# Altium schematic sheet 220VAC_to_24VDC.SchDoc
size 165 x 241 mm; DocumentNumber: 1; SheetNumber: 1; SheetTotal: 3
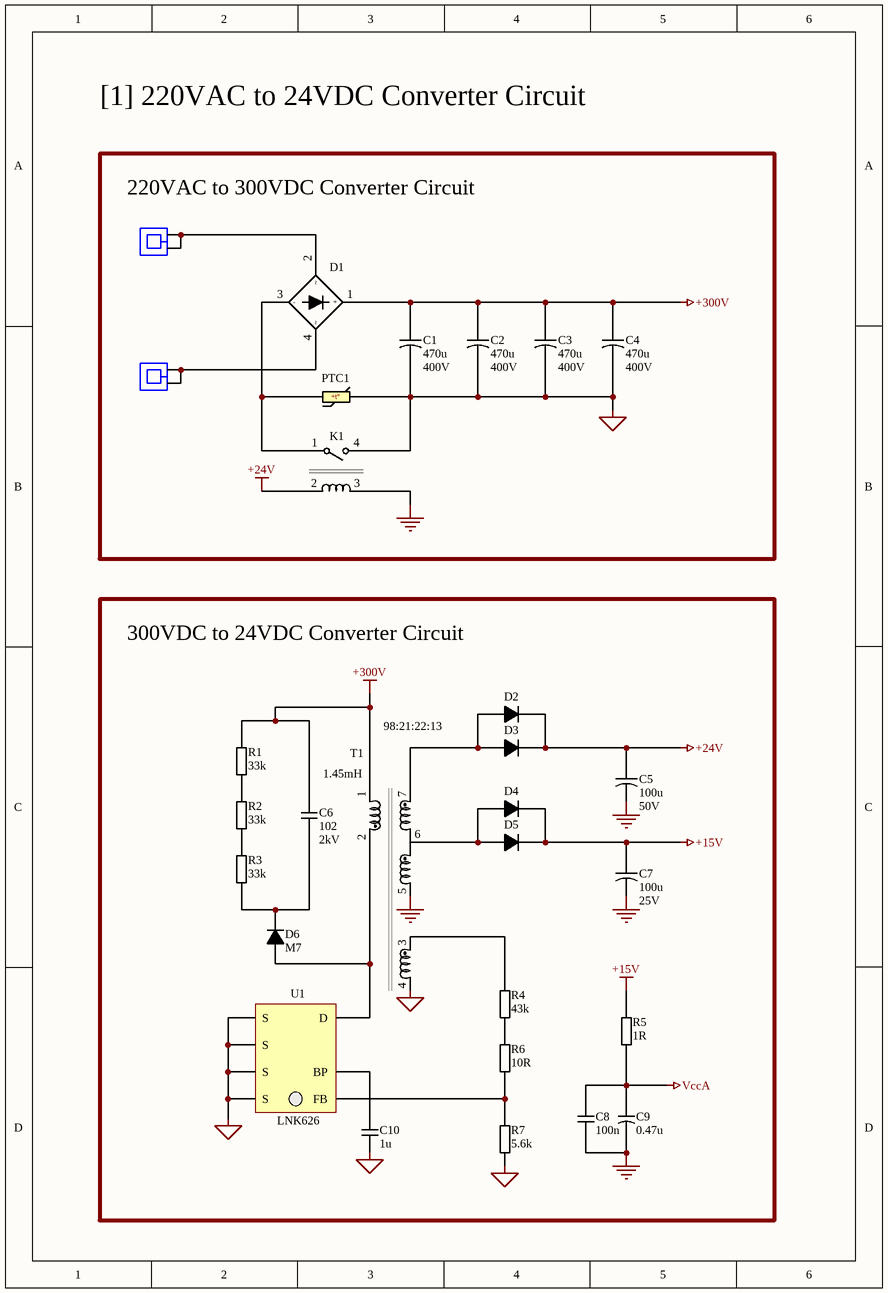
[diagram p0: 220VAC_to_24VDC.SchDoc]

## Parts
C1  470u  Voltage: 400V  [Cap_THD_Alum_10mm]
C2  470u  Voltage: 400V  [Cap_THD_Alum_10mm]
C3  470u  Voltage: 400V  [Cap_THD_Alum_10mm]
C4  470u  Voltage: 400V  [Cap_THD_Alum_10mm]
C5  100u  Voltage: 50V  [Cap_THD_Alum_2.5mm]
C6  102  Voltage: 2kV  [Cap_THD_HVCeramic_5mm]
C7  100u  Voltage: 25V  [Cap_THD_Alum_2.5mm]
C8  100n  [Cap_SMD_0805]
C9  0.47u  [Cap_THD_Tantalum_2.5mm]
C10  1u  [Cap_SMD_0805]
D1  D  [Bridge_THD_14.3mm]  (value not drawn)
D2  UF4007  [Diode_THD_10.8mm]  (value not drawn)
D3  UF4007  [Diode_THD_10.8mm]  (value not drawn)
D4  UF4007  [Diode_THD_10.8mm]  (value not drawn)
D5  UF4007  [Diode_THD_10.8mm]  (value not drawn)
D6  M7  [Diode_SMD_3.9mm]
J1  63824-1  [CONN_QC_Faston_5mm]  (value not drawn)
J2  63824-1  [CONN_QC_Faston_5mm]  (value not drawn)
K1  K  [Relay_10mm]  (value not drawn)
PTC1  (no value)  [PTC_THD_5mm]
R1  33k  [Res_SMD_0805]
R2  33k  [Res_SMD_0805]
R3  33k  [Res_SMD_0805]
R4  43k  [Res_SMD_0805]
R5  1R  [Res_SMD_2512]
R6  10R  [Res_SMD_0805]
R7  5.6k  [Res_SMD_0805]
T1  1.45mH  Turns Ratio: 98:21:22:13  [XFMR_BR22EEL_1179A]
U1  LNK626  [DIP8]

## Blocks framed on the sheet
220VAC to 300VDC Converter Circuit: C1-C4 D1 J1 J2 K1 PTC1
300VDC to 24VDC Converter Circuit: C5-C10 D2-D6 R1-R7 T1 U1

## Nets
+15V: C7.1(+) D4.2(K) D5.2(K) R5.1
+24V: C5.1(+) D2.2(K) D3.2(K) K1.2(Coil_1)
+300V: C1.1(+) C2.1(+) C3.1(+) C4.1(+) C6.2 D1.1(+) R1.2 T1.1
GND: C5.2(-) C7.2(-) C8.1 C9.2(-) K1.3(Coil_2) T1.5
GND_1: C1.2(-) C2.2(-) C3.2(-) C4.2(-) C10.1 K1.4(SW_2) PTC1.2 R7.1 T1.4 U1.5(S) U1.6(S) U1.7(S) U1.8(S)
VccA: C8.2 C9.1(+) R5.2
NetC6_1: C6.1 D6.1(K) R3.1
NetC10_2: C10.2 U1.2(BP)
NetD1_2: D1.2 J1.1 J1.2
NetD1_3: D1.3(-) K1.1(SW_1) PTC1.1
NetD1_4: D1.4 J2.1 J2.2
NetD2_1: D2.1(A) D3.1(A) T1.7
NetD4_1: D4.1(A) D5.1(A) T1.6
NetD6_2: D6.2(A) T1.2 U1.4(D)
NetR1_1: R1.1 R2.2
NetR2_1: R2.1 R3.2
NetR4_1: R4.1 R6.2
NetR4_2: R4.2 T1.3
NetR6_1: R6.1 R7.2 U1.1(FB)

Not connected (* = marked no-connect by the designer): U1 3(NC)

## Notes on the sheet
- [1] 220VAC to 24VDC Converter Circuit
- (in symbol ICL_PTC) +t°

## Library data of the parts
C1-C5 C7 = Cap_THD_Alum: THD Aluminum Capacitor
C6 = Cap_THD_Ceramic: THD Ceramic Capacitor
C8 C10 = Cap_SMD_0805: 0805 SMD Capacitor
C9 = Cap_THD_Tantalum_2.5mm: Voltage: V
D1 = Diode_Bridge_V1: Full Wave Diode Bridge 1
D2-D6 = Diode_Rectifier: Rectifier Diode
J1 J2 = CONN_QC_Faston: Quick Connect Terminal; Manufacturer: TE Connectivity; Body Material: Brass; Plating: Tin; Gender: Male; Insulation: Non-Insulated; Tab Width: 6.35mm; Tab Thickness: 0.83mm; Mating Tab Width: 0.25inch; Hole Diameter: 0.055inch; PCB Thickness: 0.062inch; Supplier 1: Arrow Electronics; Manufacturer Part Number: 63824-1; RoHS: Yes; Category: Terminals; Stock 1: 23665; Pricing 1: 1=0.0808, 10=0.0729, 25=0.053, 100=0.0524, 250=0.0519, 500=0.0514, 1000=0.0509, 3000=0.0504, 6000=0.0448, 15000=0.0426 (USD); Mount: Through Hole; Contact Material: Brass; Contact Plating: Tin; Color: Silver; Material: Brass; Body Plating: Tin; Terminal Material: Brass; Min Operating Temperature: -30°C; Max Operating Temperature: 110°C; Package Quantity: 10000; Packaging: Tape and Reel; Termination: Tab; Orientation: Straight; Series: Faston; Length: 13.63mm; Height: 14.02mm; Depth: 7.92mm; Size: 0.032inch; Radiation Hardening: No; Lead Free: Lead Free; ELV: Compliant; RoHS Compliant: Yes; Reach SVHC Compliant: Unknown; ComponentLink1URL: https://datasheet.ciiva.com/11721/0900766b80ddd72b-11721738.pdf?src-supplier=Rs; ComponentLink1Description: https://datasheet.ciiva.com/11721/0900766b80ddd72b-11721738.pdf?src-supplier=Rs; ComponentLink2URL: https://datasheet.ciiva.com/839/eng-cd-63824-r-basefilename-839115.pdf?src-supplier=Digi-Key; ComponentLink2Description: https://datasheet.ciiva.com/839/eng-cd-63824-r-basefilename-839115.pdf?src-supplier=Digi-Key; ComponentLink3URL: https://datasheet.ciiva.com/46393/1650963-46393511.pdf?src-supplier=Element14; ComponentLink3Description: https://datasheet.ciiva.com/46393/1650963-46393511.pdf?src-supplier=Element14; ComponentLink4URL: https://datasheet.ciiva.com/7873/1650963-7873563.pdf?src-supplier=Element14; ComponentLink4Description: https://datasheet.ciiva.com/7873/1650963-7873563.pdf?src-supplier=Element14; ComponentLink5URL: https://datasheet.ciiva.com/3144/eng-cs-82004-faston-pcb-tabs-receptacles-0914-3144076.pdf?src-supplier=Avnet; ComponentLink5Description: https://datasheet.ciiva.com/3144/eng-cs-82004-faston-pcb-tabs-receptacles-0914-3144076.pdf?src-supplier=Avnet; Supplier Part Number 1: 63824-1
K1 = Relay_Generic_V2
PTC1 = ICL_PTC: PTC Inrush Current Limiters
R1-R7 = Res_SMD: SMD Resistor
T1 = XFMR_BR22EEL_1179A: 98:21:22:13 Pulse Transformer; Lprimary: 1.45mH